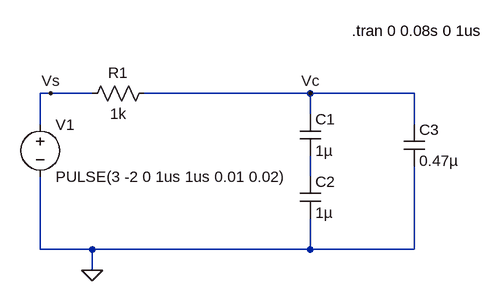
[diagram p0: schematic Transient.asc]
Transient.asc, the LTspice schematic file:
Version 4
SHEET 1 880 680
WIRE 96 128 80 128
WIRE 160 128 96 128
WIRE 496 128 240 128
WIRE 656 128 496 128
WIRE 496 160 496 128
WIRE 80 176 80 128
WIRE 656 176 656 128
WIRE 496 256 496 224
WIRE 80 368 80 256
WIRE 160 368 80 368
WIRE 496 368 496 320
WIRE 496 368 160 368
WIRE 656 368 656 240
WIRE 656 368 496 368
WIRE 160 400 160 368
FLAG 96 128 Vs
FLAG 496 128 Vc
FLAG 160 400 0
SYMBOL voltage 80 160 R0
WINDOW 123 0 0 Left 0
WINDOW 39 0 0 Left 0
SYMATTR InstName V1
SYMATTR Value PULSE(3 -2 0 1us 1us 0.01 0.02)
SYMBOL res 256 112 R90
WINDOW 0 0 56 VBottom 2
WINDOW 3 32 56 VTop 2
SYMATTR InstName R1
SYMATTR Value 1k
SYMBOL cap 480 160 R0
SYMATTR InstName C1
SYMATTR Value 1µ
SYMBOL cap 480 256 R0
SYMATTR InstName C2
SYMATTR Value 1µ
SYMBOL cap 640 176 R0
SYMATTR InstName C3
SYMATTR Value 0.47µ
TEXT 560 32 Left 2 !.tran 0 0.08s 0 1us

The netlist it stands for:
* Transient.asc
V1 Vs 0 PULSE(3 -2 0 1us 1us 0.01 0.02)
R1 Vc Vs 1k
C1 Vc N001 1µ
C2 N001 0 1µ
C3 Vc 0 0.47µ
.tran 0 0.08s 0 1us
.backanno
.end

* Results of the author's LTspice run, read from the files saved beside the schematic
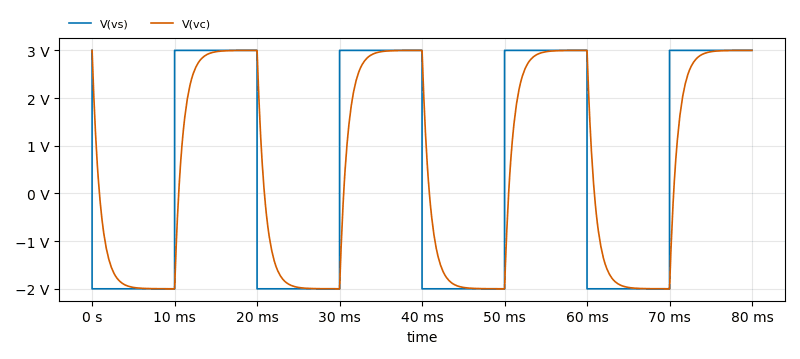
[diagram p1: Transient Analysis of Transient.asc, plotted from the saved traces]
* Transient Analysis, 1 run:
*   V(vs): min -2 V, max 3 V, average 499.8 mV, rms 2.549 V, last 3 V
*   V(vc): min -2 V, max 3 V, average 499.6 mV, rms 2.3 V, last 3 V